# Altium project AOZ2262AQI-18_testPCBrjPcb.PrjPcb
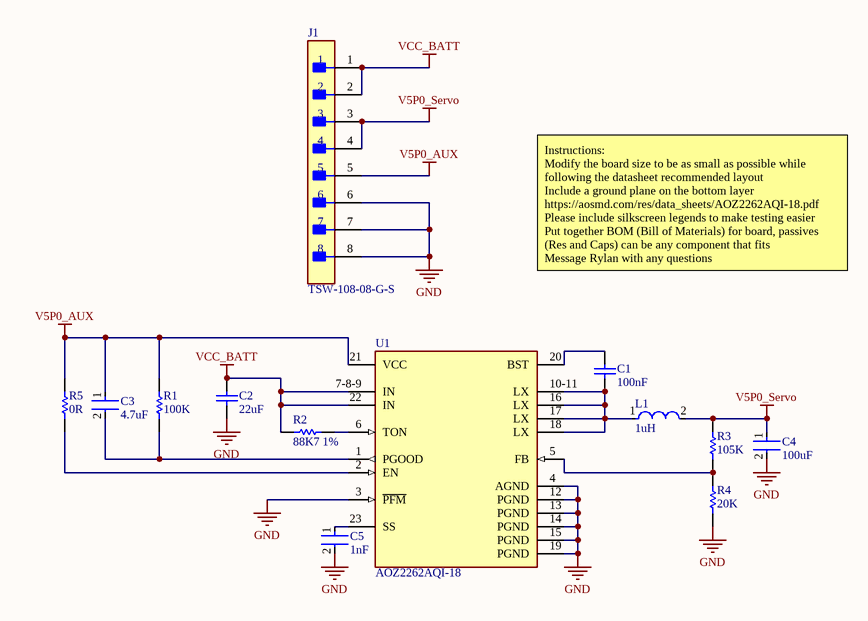
[diagram p0: AOZ2262AQI-18_SCH.SchDoc]
1 sheet, 13 parts. Net scope: global (net labels, ports and power ports of the same name join across sheets).
Board file: AOZ2262AQI-18_PCB.PcbDoc

## Sheet AOZ2262AQI-18_SCH.SchDoc
size A; SheetNumber: 1; SheetTotal: 1

### Parts
C1  100nF  [0603]
C2  22uF  [CAPC1608X100X20ML10]
C3  4.7uF  [FP-C0603-CG-MFG]
C4  100uF  [FP-C1210C107M9PACTU-MFG]
C5  1nF  [FP-0603-L_1_6_0_15-W_0_81-IPC_A]
J1  TSW-108-08-G-S  [FP-TSW-108-08-G-S-MFG]  (no BOM)
L1  1uH  [FP-IHLP-4040DZ-FP_3_175x4-MFG]
R1  100K  [0603]
R2  88K7 1%  [0603]
R3  105K  [RESC1608X55X30NL15T15]
R4  20K  [RESC1609X50X30ML10T20]
R5  0R  [RESC2013X60X35ML10T20]
U1  AOZ2262AQI-18  [FP-QFN4x4B_23L_EP2_S-MFG]

### Nets
GND: C2.2 C4.2 C5.2 J1.6 J1.7 J1.8 R4.1 U1.3(~{PFM}) U1.4(AGND) U1.12(PGND) U1.13(PGND) U1.14(PGND) U1.15(PGND) U1.19(PGND)
V5P0_AUX: C3.1 J1.5 R1.1 R5.2 U1.21(VCC)
V5P0_Servo: C4.1 J1.3 J1.4 L1.2 R3.2
VCC_BATT: C2.1 J1.1 J1.2 R2.1 U1.7-8-9(IN) U1.22(IN)
NetC1_1: C1.1 L1.1 U1.10-11(LX) U1.16(LX) U1.17(LX) U1.18(LX)
NetC1_2: C1.2 U1.20(BST)
NetC3_2: C3.2 R1.2 U1.1(PGOOD)
NetC5_1: C5.1 U1.23(SS)
NetR2_2: R2.2 U1.6(TON)
NetR3_1: R3.1 R4.2 U1.5(FB)
NetR5_1: R5.1 U1.2(EN)

### Notes on the sheet
- Instructions:
  Modify the board size to be as small as possible while
  following the datasheet recommended layout
  Include a ground plane on the bottom layer
  https://aosmd.com/res/data_sheets/AOZ2262AQI-18.pdf
  Please include silkscreen legends to make testing easier
  Put together BOM (Bill of Materials) for board, passives
  (Res and Caps) can be any component that fits
  Message Rylan with any questions

### Library data of the parts
C1 = 100nF 0603: CAP 100nF 100V ±10% 0603 (1608 Metric) Thickness 1mm SMD; Tolerance: Â±10%; Case-Metric: 1608; Rated Voltage: 100 V; Case-EIA: 0603; Value: 100nF; Technology: SMT; Max Thickness: 1 mm; ComponentLink1Description: Link; ComponentLink1URL: https://www.digikey.com/en/products/detail/samsung-electro-mechanics/CL10B104KC8NNNC/5961291
C2 = CMP-2000-05440-1: Chip Capacitor, 22 uF, +/- 20%, 6.3 V, -55 to 85 degC, 1608 (0603 Metric), RoHS, Tape and Reel; PCN Part Number: MLCCPartNumberChange30/Nov/2012; Manufacturer: TDK; Temperature Coefficient: X5R; Product Training Modules: CSeriesGeneralApplicationsSEAT,CCV,andTVCLDesignToolsGuidetoReplacinganElectrolyticCapacitorwithanMLCC; Other Names: 445-8028-1; Capacitance: 22µF; Voltage - Rated: 6.3V; Design Resources: 20WNon-IsolatedBuckLEDDriverUsingPLLNK460KG; Online Catalog: CSeries,GeneralPurpose; Kits: 445-9003-KIT-ND-KITCAPCERHICAPMLCCSMD; Tolerance: ±20%; Series: C; Thickness (Max): 0.039"(1.00mm); Mounting Type: SurfaceMount,MLCC; Ratings: -; Datasheet Version: Mar-15; Package Reference: 603; Packaging: CutTape(CT); Features: -; Package / Case: 0603(1608Metric); Family: CeramicCapacitors; Lead Spacing: -; RoHS Information: RoHSCertificate-MLCC; Manufacturer URL: http://www.tdk.com/; Lead Style: -; Category: Capacitors; Applications: GeneralPurpose; Package Description: 2-Pin Surface Mount Device, Body 1.6 x 0.8 mm; Standard Package: 1; Datasheet URL: http://www.farnell.com/datasheets/1913358.pdf; Height - Seated (Max): -; Operating Temperature: -55degC~85degC; Size / Dimension: 0.063"Lx0.031"W(1.60mmx0.80mm)
C3 = CMP-2006-02256-2: CAP CER 4.7UF 6.3V X5R 0603; Manufacturer: Kemet; Manufacturer Part Number: C0603C475K9PACTU; Temperature Coefficient: 15%; Tolerance: 10%; Material: Ceramic; Device Class L3: Ceramic Capacitors; RoHS: TRUE; Value: 4.7uF; Lead Free: Yes; ComponentLink2Description: Datasheet; Mouser Description: Multilayer Ceramic Capacitors MLCC - SMD/SMT 6.3volts 4.7uF X5R 10%; Package: C0603-CG; Digikey Description: CAP CER 4.7UF 6.3V X5R 0603; ComponentLink2URL: https://content.kemet.com/datasheets/KEM_C1006_X5R_SMD.pdf; Category: Cap; Temperature Range Low: -55°C; Capacitance: 4.7uF; Temperature: -55°C to +85°C; Octopart: https://octopart.com/c0603c475k9pactu-kemet-104242; Ipc Land Pattern Name: CAPC16080X80; Voltage Rating: 6.3V; Temperature Range High: +85°C; Height: 0.9mm; Temperature Characteristic: X5R; Device Class L1: Passive Components; Automotive: No; Device Class L2: Capacitors
C4 = CMP-2000-06018-2: CAP CER 100UF 6.3V X5R 1210; Dissipation Factor: 5%; Dielectric Material: Ceramic; Tolerance: 20%; Termination: SMD/SMT; REACH SVHC: No SVHC; Thickness: 0.11inch; Packaging: Tape and Reel; Series: C; Width: 2.5mm; Voltage Rating (DC): 6.3V; Voltage: 6.3V; Contact Plating: Tin; Package Quantity: 1; Case/Package: 1210; Min Operating Temperature: -55°C; Height: 2.5mm; Radiation Hardening: No; Capacitance: 100uF; Case Code (Metric): 3225; Depth: 2.5mm; Construction: Flat; Max Operating Temperature: 85°C; Number of Pins: 2; Mount: Surface Mount; Lead Free: Lead Free; RoHS Compliant: Yes; Voltage Rating: 6.3V; Dielectric: X5R; Length: 3.2mm; Case Code (Imperial): 1210
C5 = CMP-2006-04378-2: General Purpose Ceramic Capacitor, 0603, 1nF, 10%, X7R, 15%, 50V; Case Code (Metric): 1608; Min Operating Temperature: -55°C; Weight: 7.1E-05oz; Series: -; Capacitance: 1nF; RoHS Compliant: Yes; Radiation Hardening: No; Height: 0.9mm; Mount: Surface Mount; REACH SVHC: No SVHC; Lead Free: Lead Free; Depth: 0.81mm; Voltage: 50V; Number of Pins: 2; Voltage Rating: 50V; Max Operating Temperature: 125°C; Termination: SMD/SMT; Construction: Flat; Case Code (Imperial): 0603; Dielectric: X7R; Width: 0.032inch; Tolerance: 10%; Case/Package: 0603; Contact Plating: Tin; Packaging: Tape and Reel; Voltage Rating (DC): 50V; Dielectric Material: Ceramic; Package Quantity: 4000; Thickness: 0.035inch; Length: 1.6mm
J1 = CMP-02766-000001-1: CONN HEADER VERT 8POS 2.54MM; Manufacturer: Samtec; Number Of Contacts: 8; Conn Orientation: Straight; Conn Gender: Male; Device Class L1: Connectors; ComponentLink2Description: Datasheet; Digikey Description: CONN HEADER VERT 8POS 2.54MM; ComponentLink2URL: http://suddendocs.samtec.com/catalog_english/tsw_th.pdf; Temperature: -55°C to +125°C; RoHS: TRUE; Mouser Description: TSW - Samtec 2.54mm Pin Header 13.46mm Overall Pin Length 5.08mm Tail; Automotive: No; Temperature Range High: +125°C; Package: TSW-108-08-G-S; Device Class L3: unset; Manufacturer Part Number: TSW-108-08-G-S; Pitch: 2.54mm; Number Of Rows: 1; Lead Free: Yes; Height: 8.71mm; Contact Material: Gold,Nickel; Footprint Url: http://suddendocs.samtec.com/prints/tsw-xxx-xx-x-x-xx-xxx-footprint.pdf; Temperature Range Low: -55°C; Octopart: https://octopart.com/tsw-108-08-g-s-samtec-272653; Category: Conn; Device Class L2: Headers and Wire Housings
L1 = CMP-02424-000442-1: Commercial Inductors, Low DCR Series 1uH 25A 2.5mΩ 20% / IHLP4040DZER1R0M11; Saturation Current: 20A; Self Resonant Frequency: 1MHz; Shielding: Shielded; Core Material: Metal; DC Resistance (DCR): 2.5mR; Test Frequency: 100kHz; Min Operating Temperature: -55°C; Package Quantity: 1; Depth: 10.3mm; Case Code (Imperial): 4040; Height - Seated (Max): 0.157inch; Width: 0.405inch; RMS Current (Irms): 25A; Height: 4mm; Length: 0.43inch; Packaging: Tape and Reel; Inductance: 1uH; Number of Pins: 2; Military Standard: Not; Current Rating: 25A; Lead Free: Lead Free; Mount: Surface Mount; Case/Package: 4040; Tolerance: 20%; Termination: SMD/SMT; Radiation Hardening: No; Inductance Tolerance: 20%; Max DC Current: 20A; Max Operating Temperature: 125°C
R1 = 100K 0603: ERJ-3EKF1003V-100k 0603; Manufacturer: Panasonic; Part Number: ERJ-3EKF1003V; ComponentLink1Description: Link; ComponentLink1URL: https://www.digikey.com/en/products/detail/yageo/RC0603FR-07100KL/726889
R2 = 88K7 0603: 88K7 0.1W 1% 0603 (1608 Metric)  SMD; Value: 88700.00 Ohm; Case-Metric: 1608; Tolerance: 1 %; Power: 0.1 W; Technology: SMT; Case-EIA: 0603; ComponentLink1Description: Link; ComponentLink1URL: https://www.digikey.com/en/products/detail/yageo/RC0603FR-0788K7L/727415
R3 = CMP-2000-00190-1: ERJ-3EKF1053V / 105K 0603; Manufacturer: Panasonic; Part Number: ERJ-3EKF1053V
R4 = CMP-1012-00655-2: CRCW060320K0FKEB / 20K 0603; Manufacturer: Vishay Dale; Part Number: CRCW060320K0FKEB
R5 = CMP-2100-03673-1: Chip Resistor, 0 Ohm, Jumper, +/- 5%, 0.125 W, -55 to 155 degC, 0805 (2012 Metric), RoHS, Tape and Reel / RC0805JR-070RL; Manufacturer: Yageo; Power Rating: 125mW; Resistance: 0mOhm; Voltage Rating (DC): 150V; Temperature Coefficient: 200ppm/degreesC; Height: 0.5mm; Depth: 1.25mm; Case Code (Imperial): 0805; Lead Free: LeadFree; Military Standard: Not; Package Description: 2-Pin Surface Mounted Device, Body 2 x 1.25 mm; Case Code (Metric): 2012; Composition: ThickFilm; Voltage Rating: 150V; Manufacturer URL: http://www.yageo.com/; Packaging: TapeandReel; Package Reference: 0805; REACH SVHC: Unknown; Tolerance: 5%; Case/Package: 0805; Max Operating Temperature: 155degC; Number of Pins: 2; Min Operating Temperature: -55degC; RoHSCompliant: true; Length: 2mm; Datasheet URL: http://www.yageo.com/NewPortal/yageodocoutput?fileName=/pdf/R-Chip/PYu-RC_Group_51_RoHS_L_5.pdf; Termination: SMD/SMT; Radiation Hardening: No; Width: 1.25mm; Contact Plating: Tin; Datasheet Version: Rev. 5, 10/2016
U1 = CMP-83911-000001-1: POWER IC EZBUCK